# EAGLE schematic switchboard 2 (EAGLE 7.2.0)
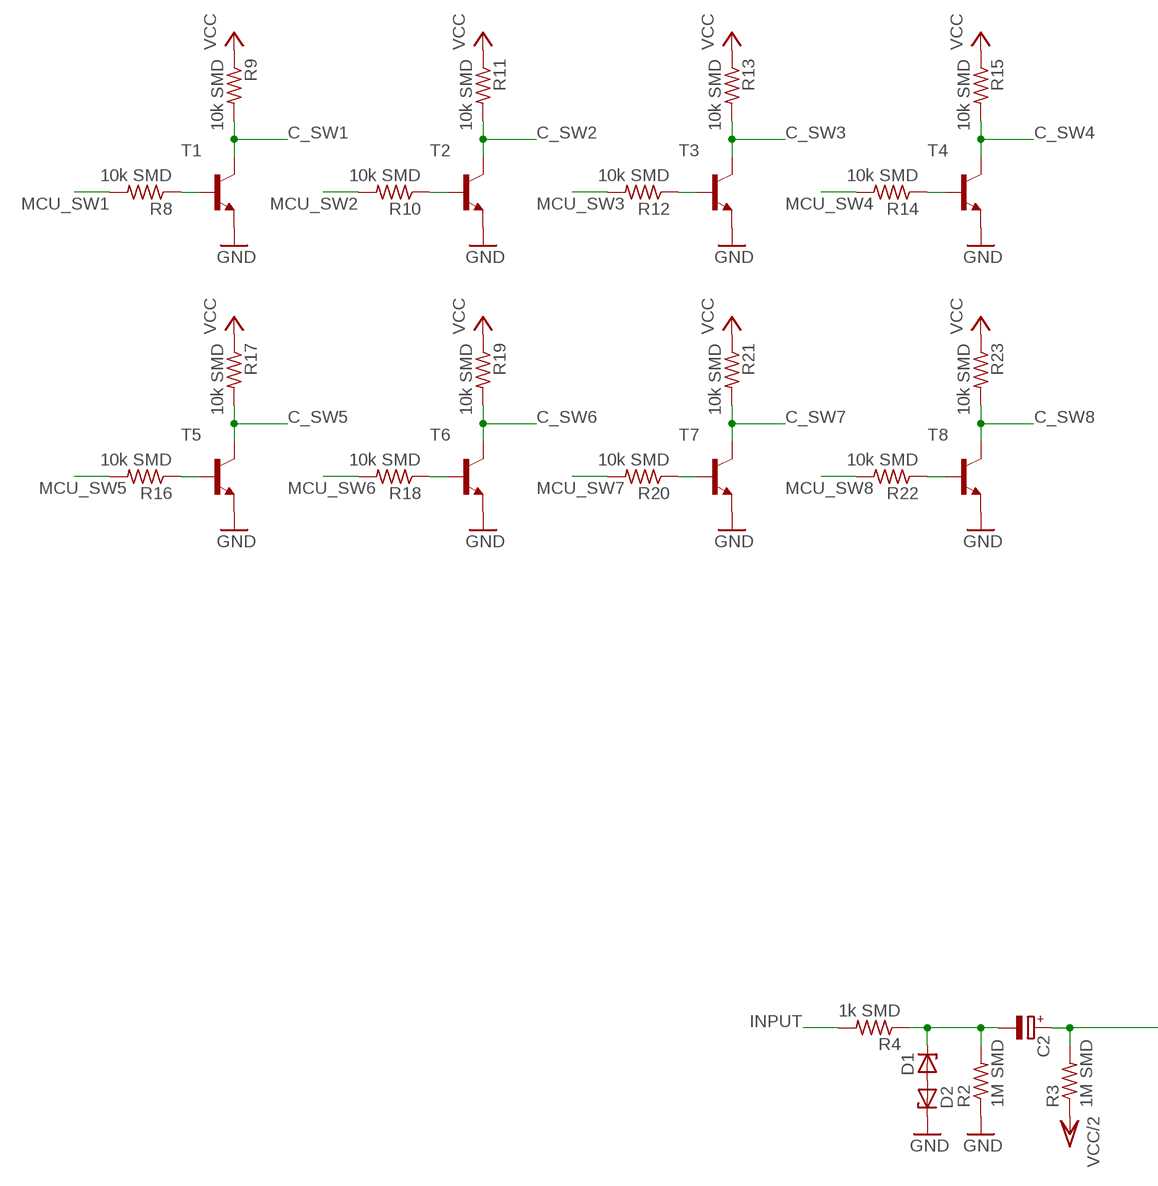
[diagram p0: schematic, sheet 1, part 1 of 2]
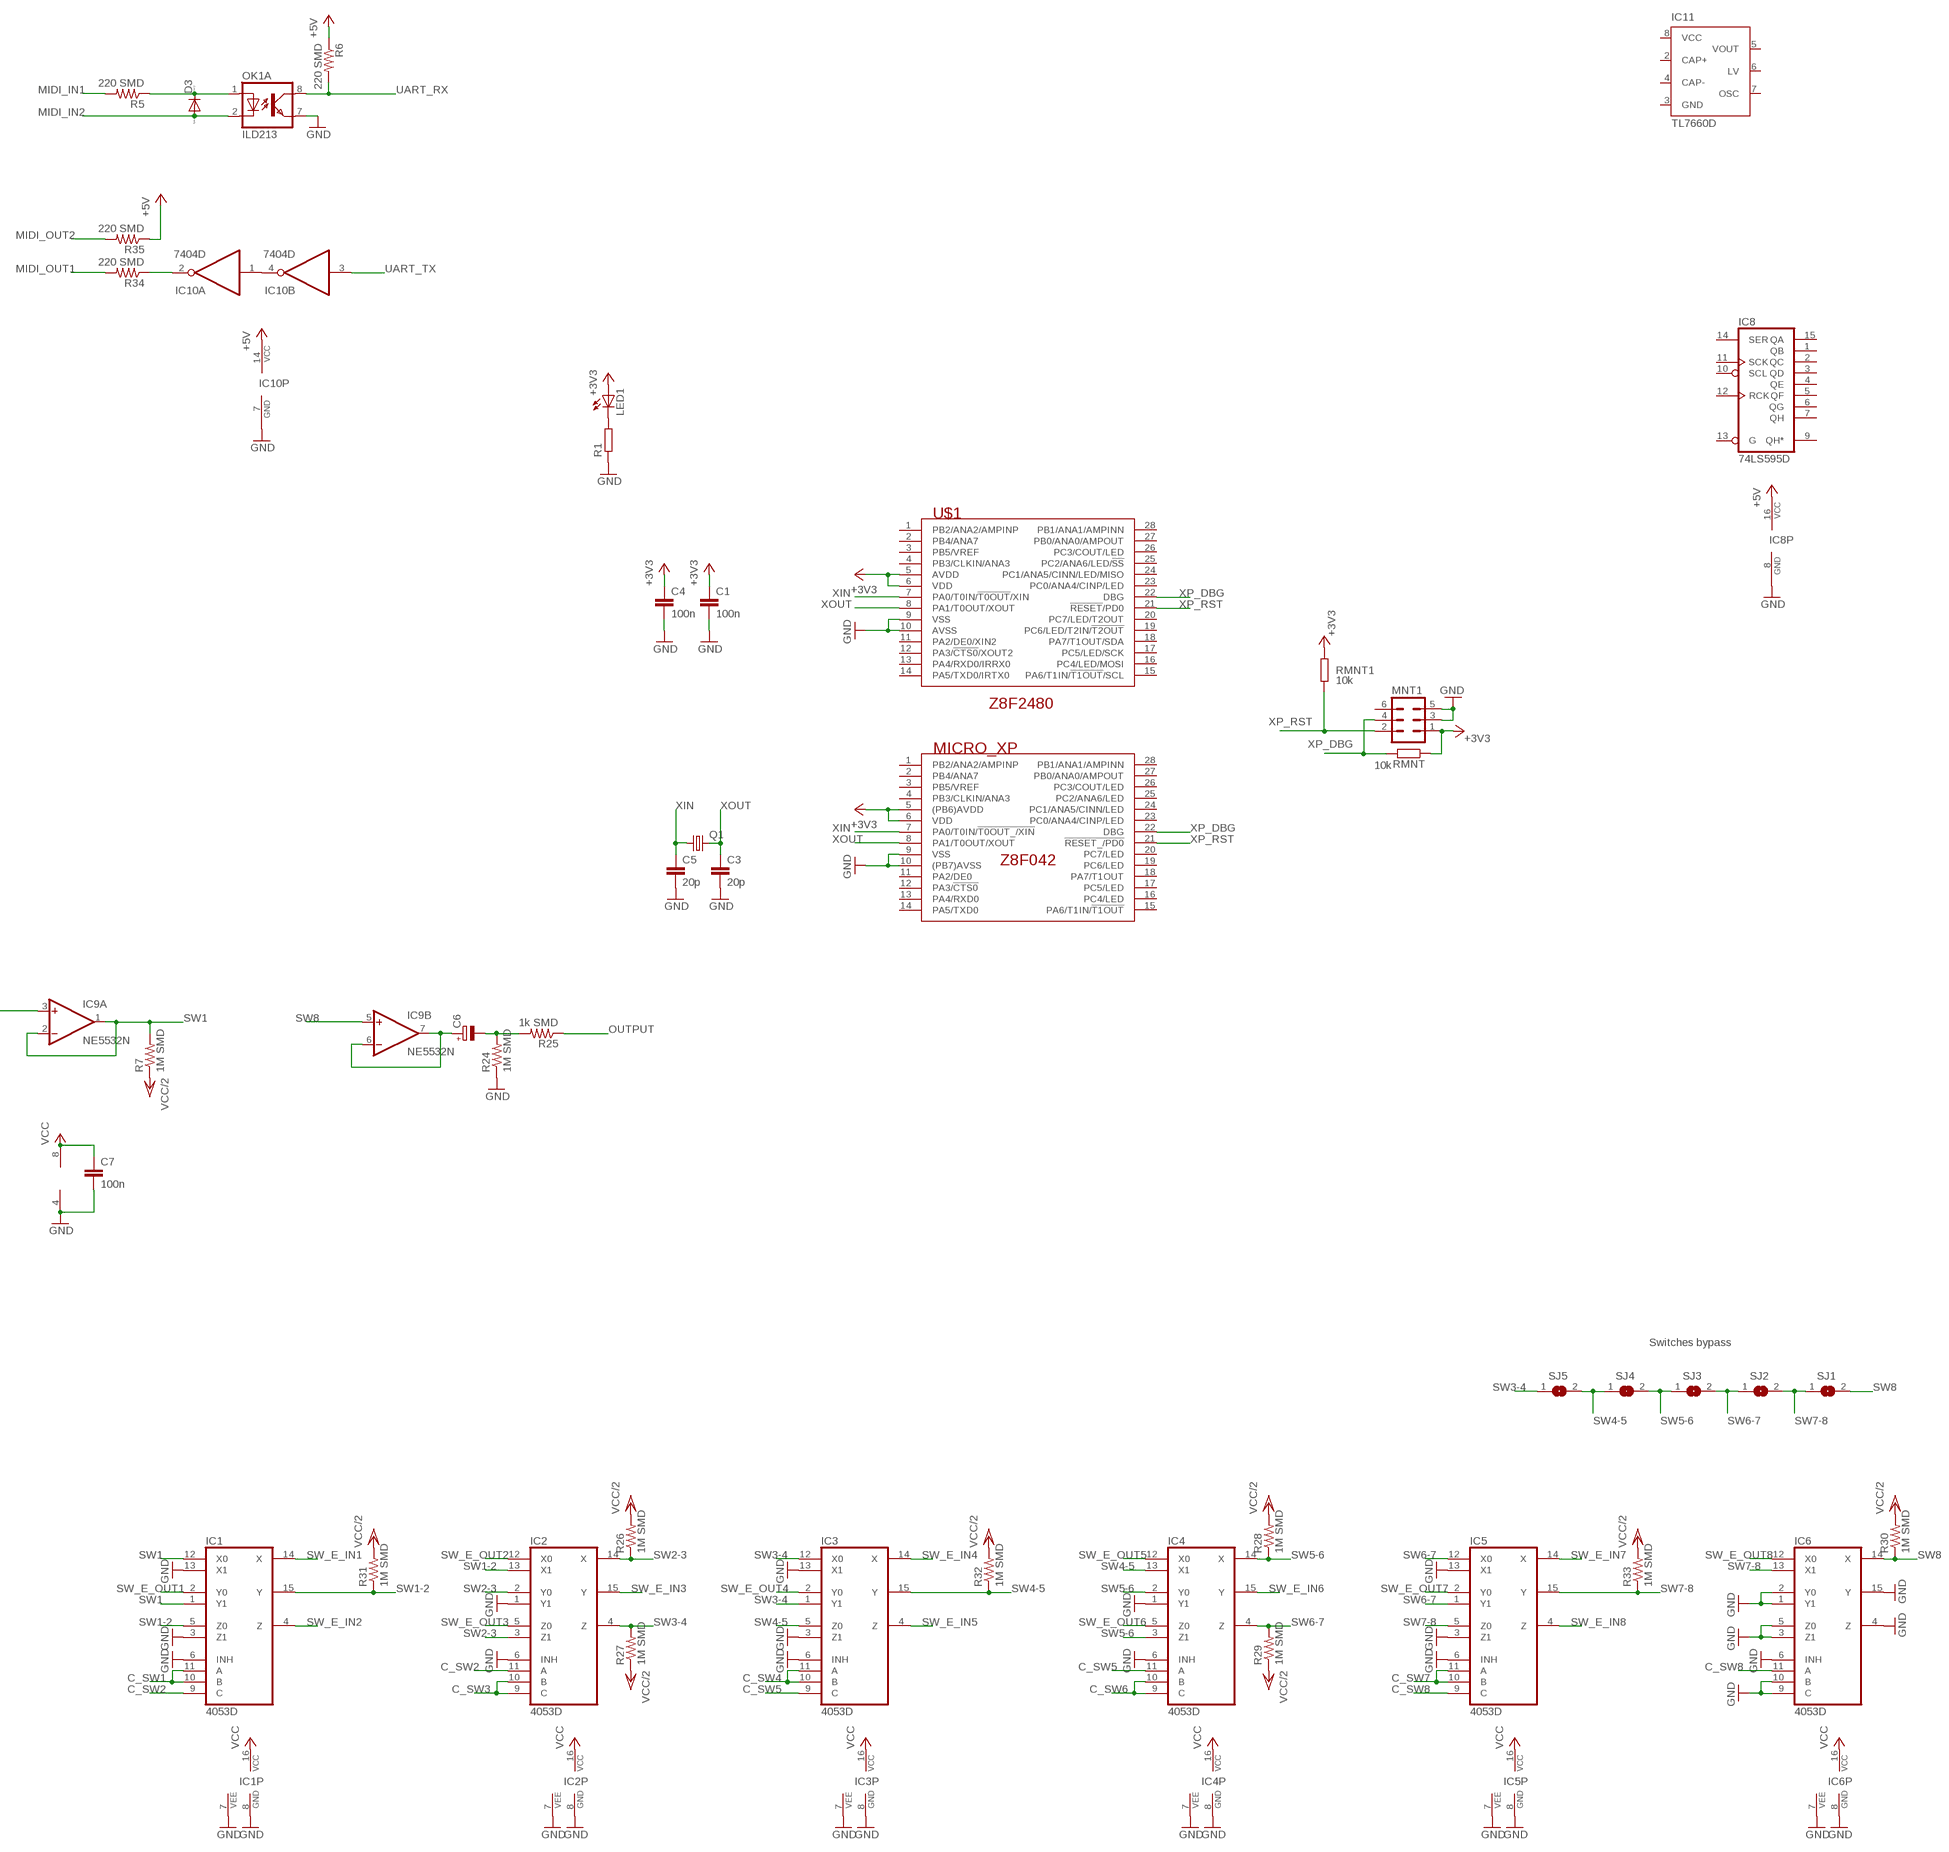
[diagram p1: schematic, sheet 1, part 2 of 2]

## Parts
C1  100n  C-EUC0603  [C0603]
C2  CPOL-EUE2.5-6  [E2,5-6]
C3  20p  C-EUC0603  [C0603]
C4  100n  C-EUC0603  [C0603]
C5  20p  C-EUC0603  [C0603]
C6  CPOL-EUE2.5-6  [E2,5-6]
C7  100n  C-EUC0603  [C0603]
D1  ZENER-DIODESMB  [SMB]
D2  ZENER-DIODESMB  [SMB]
D3  DIODE-MINIMELF  [MINIMELF]
IC1  4053D  [SO16]
IC2  4053D  [SO16]
IC3  4053D  [SO16]
IC4  4053D  [SO16]
IC5  4053D  [SO16]
IC6  4053D  [SO16]
IC8  74LS595D  [SO16]
IC9  NE5532N  [DIL08]
IC10  7404D  [SO14]
IC11  TL7660D  [D_R-PDSO-G08]
LED1  LEDCHIPLED_0805  [CHIPLED_0805]
MICRO_XP  Z8F042A  [SSOP28]
MNT1  MA03-2  [MA03-2]
OK1  ILD213  [SOIC08]
Q1  CRYSTALHC49S  [HC49/S]
R1  R-EU_R0805  [R0805]
R2  1M SMD  R-US_R0805  [R0805]
R3  1M SMD  R-US_R0805  [R0805]
R4  1k SMD  R-US_R0805  [R0805]
R5  220 SMD  R-US_R0805  [R0805]
R6  220 SMD  R-US_R0805  [R0805]
R7  1M SMD  R-US_R0805  [R0805]
R8  10k SMD  R-US_R0805  [R0805]
R9  10k SMD  R-US_R0805  [R0805]
R10  10k SMD  R-US_R0805  [R0805]
R11  10k SMD  R-US_R0805  [R0805]
R12  10k SMD  R-US_R0805  [R0805]
R13  10k SMD  R-US_R0805  [R0805]
R14  10k SMD  R-US_R0805  [R0805]
R15  10k SMD  R-US_R0805  [R0805]
R16  10k SMD  R-US_R0805  [R0805]
R17  10k SMD  R-US_R0805  [R0805]
R18  10k SMD  R-US_R0805  [R0805]
R19  10k SMD  R-US_R0805  [R0805]
R20  10k SMD  R-US_R0805  [R0805]
R21  10k SMD  R-US_R0805  [R0805]
R22  10k SMD  R-US_R0805  [R0805]
R23  10k SMD  R-US_R0805  [R0805]
R24  1M SMD  R-US_R0805  [R0805]
R25  1k SMD  R-US_R0805  [R0805]
R26  1M SMD  R-US_R0805  [R0805]
R27  1M SMD  R-US_R0805  [R0805]
R28  1M SMD  R-US_R0805  [R0805]
R29  1M SMD  R-US_R0805  [R0805]
R30  1M SMD  R-US_R0805  [R0805]
R31  1M SMD  R-US_R0805  [R0805]
R32  1M SMD  R-US_R0805  [R0805]
R33  1M SMD  R-US_R0805  [R0805]
R34  220 SMD  R-US_R0805  [R0805]
R35  220 SMD  R-US_R0805  [R0805]
RMNT  10k  R-EU_R0603  [R0603]
RMNT1  10k  R-EU_R0603  [R0603]
SJ1  SJ  [SJ]
SJ2  SJ  [SJ]
SJ3  SJ  [SJ]
SJ4  SJ  [SJ]
SJ5  SJ  [SJ]
T1  MMBT2222ALT1-NPN-SOT23-BEC  [SOT23-BEC]
T2  MMBT2222ALT1-NPN-SOT23-BEC  [SOT23-BEC]
T3  MMBT2222ALT1-NPN-SOT23-BEC  [SOT23-BEC]
T4  MMBT2222ALT1-NPN-SOT23-BEC  [SOT23-BEC]
T5  MMBT2222ALT1-NPN-SOT23-BEC  [SOT23-BEC]
T6  MMBT2222ALT1-NPN-SOT23-BEC  [SOT23-BEC]
T7  MMBT2222ALT1-NPN-SOT23-BEC  [SOT23-BEC]
T8  MMBT2222ALT1-NPN-SOT23-BEC  [SOT23-BEC]
U$1  Z8F2480SO  [SO28W]

## Nets
+3V3: C1.1 C4.1 LED1.A MICRO_XP.5((PB6)AVDD) MICRO_XP.6(VDD) MNT1.1 RMNT1.1 RMNT.1 U$1.5(AVDD) U$1.6(VDD)
+5V: IC8.16(VCC) IC10.14(P:VCC) R6.1 R35.1
C_SW1: IC1.10(B) IC1.11(A) R9.2 T1.C
C_SW2: IC1.9(C) IC2.11(A) R11.2 T2.C
C_SW3: IC2.9(C) IC2.10(B) R13.2 T3.C
C_SW4: IC3.10(B) IC3.11(A) R15.2 T4.C
C_SW5: IC3.9(C) IC4.11(A) R17.2 T5.C
C_SW6: IC4.9(C) IC4.10(B) R19.2 T6.C
C_SW7: IC5.10(B) IC5.11(A) R21.2 T7.C
C_SW8: IC5.9(C) IC6.11(A) R23.2 T8.C
GND: C1.2 C3.2 C4.2 C5.2 C7.2 D2.C IC1.3(Z1) IC1.6(INH) IC1.7(VEE) IC1.8(GND) IC1.13(X1) IC2.1(Y1) IC2.6(INH) IC2.7(VEE) IC2.8(GND) IC3.3(Z1) IC3.6(INH) IC3.7(VEE) IC3.8(GND) IC3.13(X1) IC4.1(Y1) IC4.6(INH) IC4.7(VEE) IC4.8(GND) IC5.3(Z1) IC5.6(INH) IC5.7(VEE) IC5.8(GND) IC5.13(X1) IC6.1(Y1) IC6.2(Y0) IC6.3(Z1) IC6.4(Z) IC6.5(Z0) IC6.6(INH) IC6.7(VEE) IC6.8(GND) IC6.9(C) IC6.10(B) IC6.15(Y) IC8.8(GND) IC9.4(P:V-) IC10.7(P:GND) MICRO_XP.9(VSS) MICRO_XP.10((PB7)AVSS) MNT1.3 MNT1.5 OK1.7(A:EMIT) R1.1 R2.1 R24.1 T1.E T2.E T3.E T4.E T5.E T6.E T7.E T8.E U$1.9(VSS) U$1.10(AVSS)
INPUT: R4.2
MCU_SW1: R8.2
MCU_SW2: R10.2
MCU_SW3: R12.2
MCU_SW4: R14.2
MCU_SW5: R16.2
MCU_SW6: R18.2
MCU_SW7: R20.2
MCU_SW8: R22.2
MIDI_IN1: R5.2
MIDI_IN2: D3.A OK1.2(A:C)
MIDI_OUT1: R34.2
MIDI_OUT2: R35.2
N$1: LED1.C R1.2
N$2: IC10.2(A:O) R34.1
N$3: C2.+ IC9.3(A:+IN) R3.2
N$4: C2.- D1.C R2.2 R4.1
N$7: R8.1 T1.B
N$8: C6.+ IC9.6(B:-IN) IC9.7(B:OUT)
N$9: R10.1 T2.B
N$13: R12.1 T3.B
N$14: C6.- R24.2 R25.2
N$15: R14.1 T4.B
N$19: R16.1 T5.B
N$21: R18.1 T6.B
N$25: R20.1 T7.B
N$27: D1.A D2.A
N$28: D3.C OK1.1(A:A) R5.1
N$32: IC10.1(A:I) IC10.4(B:O)
N$33: R22.1 T8.B
OUTPUT: R25.1
SW1: IC1.1(Y1) IC1.12(X0) IC9.1(A:OUT) IC9.2(A:-IN) R7.2
SW1-2: IC1.5(Z0) IC1.15(Y) IC2.13(X1) R31.1
SW2-3: IC2.2(Y0) IC2.3(Z1) IC2.14(X) R26.1
SW3-4: IC2.4(Z) IC3.1(Y1) IC3.12(X0) R27.2 SJ5.1
SW4-5: IC3.5(Z0) IC3.15(Y) IC4.13(X1) R32.1 SJ4.1 SJ5.2
SW5-6: IC4.2(Y0) IC4.3(Z1) IC4.14(X) R28.1 SJ3.1 SJ4.2
SW6-7: IC4.4(Z) IC5.1(Y1) IC5.12(X0) R29.2 SJ2.1 SJ3.2
SW7-8: IC5.5(Z0) IC5.15(Y) IC6.13(X1) R33.1 SJ1.1 SJ2.2
SW8: IC6.14(X) IC9.5(B:+IN) R30.1 SJ1.2
SW_E_IN1: IC1.14(X)
SW_E_IN2: IC1.4(Z)
SW_E_IN3: IC2.15(Y)
SW_E_IN4: IC3.14(X)
SW_E_IN5: IC3.4(Z)
SW_E_IN6: IC4.15(Y)
SW_E_IN7: IC5.14(X)
SW_E_IN8: IC5.4(Z)
SW_E_OUT1: IC1.2(Y0)
SW_E_OUT2: IC2.12(X0)
SW_E_OUT3: IC2.5(Z0)
SW_E_OUT4: IC3.2(Y0)
SW_E_OUT5: IC4.12(X0)
SW_E_OUT6: IC4.5(Z0)
SW_E_OUT7: IC5.2(Y0)
SW_E_OUT8: IC6.12(X0)
UART_RX: OK1.8(A:COL) R6.2
UART_TX: IC10.3(B:I)
VCC: C7.1 IC1.16(VCC) IC2.16(VCC) IC3.16(VCC) IC4.16(VCC) IC5.16(VCC) IC6.16(VCC) IC9.8(P:V+) R9.1 R11.1 R13.1 R15.1 R17.1 R19.1 R21.1 R23.1
VCC/2: R3.1 R7.1 R26.2 R27.1 R28.2 R29.1 R30.2 R31.2 R32.2 R33.2
XIN: C5.1 MICRO_XP.7(PA0/T0IN/!T0OUT_/XIN) Q1.1 U$1.7(PA0/T0IN/!T0OUT!/XIN)
XOUT: C3.1 MICRO_XP.8(PA1/T0OUT/XOUT) Q1.2 U$1.8(PA1/T0OUT/XOUT)
XP_DBG: MICRO_XP.22(DBG) MNT1.4 RMNT.2 U$1.22(DBG)
XP_RST: MICRO_XP.21(!RESET_/PD0) MNT1.2 RMNT1.2 U$1.21(!RESET!/PD0)
Unconnected: IC8.1(QB) IC8.2(QC) IC8.3(QD) IC8.4(QE) IC8.5(QF) IC8.6(QG) IC8.7(QH) IC8.9(QH*) IC8.10(SCL) IC8.11(SCK) IC8.12(RCK) IC8.13(G) IC8.14(SER) IC8.15(QA) IC10.5(C:I) IC10.6(C:O) IC10.8(D:O) IC10.9(D:I) IC10.10(E:O) IC10.11(E:I) IC10.12(F:O) IC10.13(F:I) IC11.2(CAP+) IC11.4(CAP-) IC11.5(VOUT) IC11.6(LV) IC11.7(OSC) MICRO_XP.1(PB2/ANA2/AMPINP) MICRO_XP.2(PB4/ANA7) MICRO_XP.3(PB5/VREF) MICRO_XP.4(PB3/CLKIN/ANA3) MICRO_XP.11(PA2/DE0) MICRO_XP.12(PA3/!CTS0) MICRO_XP.13(PA4/RXD0) MICRO_XP.14(PA5/TXD0) MICRO_XP.15(PA6/T1IN/!T1OUT) MICRO_XP.16(PC4/LED) MICRO_XP.17(PC5/LED) MICRO_XP.18(PA7/T1OUT) MICRO_XP.19(PC6/LED) MICRO_XP.20(PC7/LED) MICRO_XP.23(PC0/ANA4/CINP/LED) MICRO_XP.24(PC1/ANA5/CINN/LED) MICRO_XP.25(PC2/ANA6/LED) MICRO_XP.26(PC3/COUT/LED) MICRO_XP.27(PB0/ANA0/AMPOUT) MICRO_XP.28(PB1/ANA1/AMPINN) MNT1.6 OK1.3(B:A) OK1.4(B:C) OK1.5(B:EMIT) OK1.6(B:COL) U$1.1(PB2/ANA2/AMPINP) U$1.2(PB4/ANA7) U$1.3(PB5/VREF) U$1.4(PB3/CLKIN/ANA3) U$1.11(PA2/DE0/XIN2) U$1.12(PA3/!CTS0!/XOUT2) U$1.13(PA4/RXD0/IRRX0) U$1.14(PA5/TXD0/IRTX0) U$1.15(PA6/T1IN/!T1OUT!/SCL) U$1.16(PC4/LED/MOSI) U$1.17(PC5/LED/SCK) U$1.18(PA7/T1OUT/SDA) U$1.19(PC6/LED/T2IN/!T2OUT!) U$1.20(PC7/LED/T2OUT) U$1.23(PC0/ANA4/CINP/LED) U$1.24(PC1/ANA5/CINN/LED/MISO) U$1.25(PC2/ANA6/LED/!SS) U$1.26(PC3/COUT/LED) U$1.27(PB0/ANA0/AMPOUT) U$1.28(PB1/ANA1/AMPINN)

## Notes on the sheet
- Switches bypass

## Power pins joined to a net without a drawn wire
GND: IC11.3(GND)
VCC: IC11.8(VCC)

## Library data of the parts
C1 C3-C5 C7 = rcl:C-EU: CAPACITOR, European symbol
C2 C6 = rcl:CPOL-EU: POLARIZED CAPACITOR, European symbol
D1 D2 = diode:ZENER-DIODE: Z-Diode
D3 = diode:DIODE-: DIODE
IC1-IC6 = 40xx:4053: Triple 2-channel ANALOG MULTIPLEXER
IC8 = 74xx-us:74*595: 8-bit SHIFT REGISTER, output latch
IC9 = linear:NE5532: AUDIO AMPLIFIER
IC10 = 74xx-us:74*04: Hex INVERTER
IC11 = texas:TL7660: CMOS VOLTAGE CONVERTER Source: http://focus.ti.com/lit/ds/scas794/scas794.pdf; MPN: TL7660CD; OC_FARNELL: 1755282; OC_NEWARK: 14M2439
LED1 = led:LED: LED OSRAM: - CHIPLED LG R971, LG N971, LY N971, LG Q971, LY Q971, LO R971, LY R971 LH N974, LH R974 LS Q976, LO Q976, LY Q976 LO Q996 - Hyper CHIPLED LW Q18S LB Q993, LB Q99A, LB R99A - SideLED LS A670, LO A670, LY A670, LG A670, LP A670 LB A673, LV A673, LT A673, LW A673 LH A674 LY A675 LS A676, LA A676, LO A676, LY A676, LW A676 LS A679, LY A679, LG A679 - Hyper Micro SIDELED® LS Y876, LA Y876, LO Y876, LY Y876 LT Y87S - SmartLED LW L88C, LW L88S LB L89C, LB L89S, LG L890 LS L89K, LO L89K, LY L89K LS L896, LA L896, LO L896, LY L896 - TOPLED LS T670, LO T670, LY T670, LG T670, LP T670 LSG T670, LSP T670, LSY T670, LOP T670, LYG T670 LG T671, LOG T671, LSG T671 LB T673, LV T673, LT T673, LW T673 LH T674 LS T676, LA T676, LO T676, LY T676, LB T676, LH T676, LSB T676, LW T676 LB T67C, LV T67C, LT T67C, LS T67K, LO T67K, LY T67K, LW E67C LS E67B, LA E67B, LO E67B, LY E67B, LB E67C, LV E67C, LT E67C LW T67C LS T679, LY T679, LG T679 LS T770, LO T770, LY T770, LG T770, LP T770 LB T773, LV T773, LT T773, LW T773 LH T774 LS E675, LA E675, LY E675, LS T675 LS T776, LA T776, LO T776, LY T776, LB T776 LHGB T686 LT T68C, LB T68C - Hyper Mini TOPLED® LB M676 - Mini TOPLED Santana® LG M470 LS M47K, LO M47K, LY M47K Source: http://www.osram.convergy.de LUXEON: - LUMILED® LXK2-PW12-R00, LXK2-PW12-S00, LXK2-PW14-U00, LXK2-PW14-V00 LXK2-PM12-R00, LXK2-PM12-S00, LXK2-PM14-U00 LXK2-PE12-Q00, LXK2-PE12-R00, LXK2-PE12-S00, LXK2-PE14-T00, LXK2-PE14-U00 LXK2-PB12-K00, LXK2-PB12-L00, LXK2-PB12-M00, LXK2-PB14-N00, LXK2-PB14-P00, LXK2-PB14-Q00 LXK2-PR12-L00, LXK2-PR12-M00, LXK2-PR14-Q00, LXK2-PR14-R00 LXK2-PD12-Q00, LXK2-PD12-R00, LXK2-PD12-S00 LXK2-PH12-R00, LXK2-PH12-S00 LXK2-PL12-P00, LXK2-PL12-Q00, LXK2-PL12-R00 Source: www.luxeon.com KINGBRIGHT: KA-3528ASYC Source: www.kingbright.com
MICRO_XP = Maxwell_Bohr:Z8F042A
MNT1 = con-lstb:MA03-2: PIN HEADER
OK1 = optocoupler:ILD2*: Siemens ILD205/206/207/211/213/217 DUAL PHOTOTRANSISTOR SMALL OUTLINE SURFACE MOUNT OPTOCOUPLER Source: 153385-da-01-en-Optocoupler_ILD205-T.pdf; MF: VISHAY/TELEFUNKEN; MPN: ILD213T; OC_FARNELL: 1045451; OC_NEWARK: 20H8680
Q1 = crystal:CRYSTAL: CRYSTAL; OC_FARNELL: 1667008; OC_NEWARK: unknown
R1 RMNT RMNT1 = rcl:R-EU_: RESISTOR, European symbol
R2-R35 = rcl:R-US_: RESISTOR, American symbol
SJ1-SJ5 = jumper:SJ: SMD solder JUMPER
T1-T8 = transistor:*-NPN-: NPN Transistror BF959 corrected 2008.03.06
U$1 = LUIS:Z8F2480